# EAGLE schematic zikburner-r1 (EAGLE 6.4)
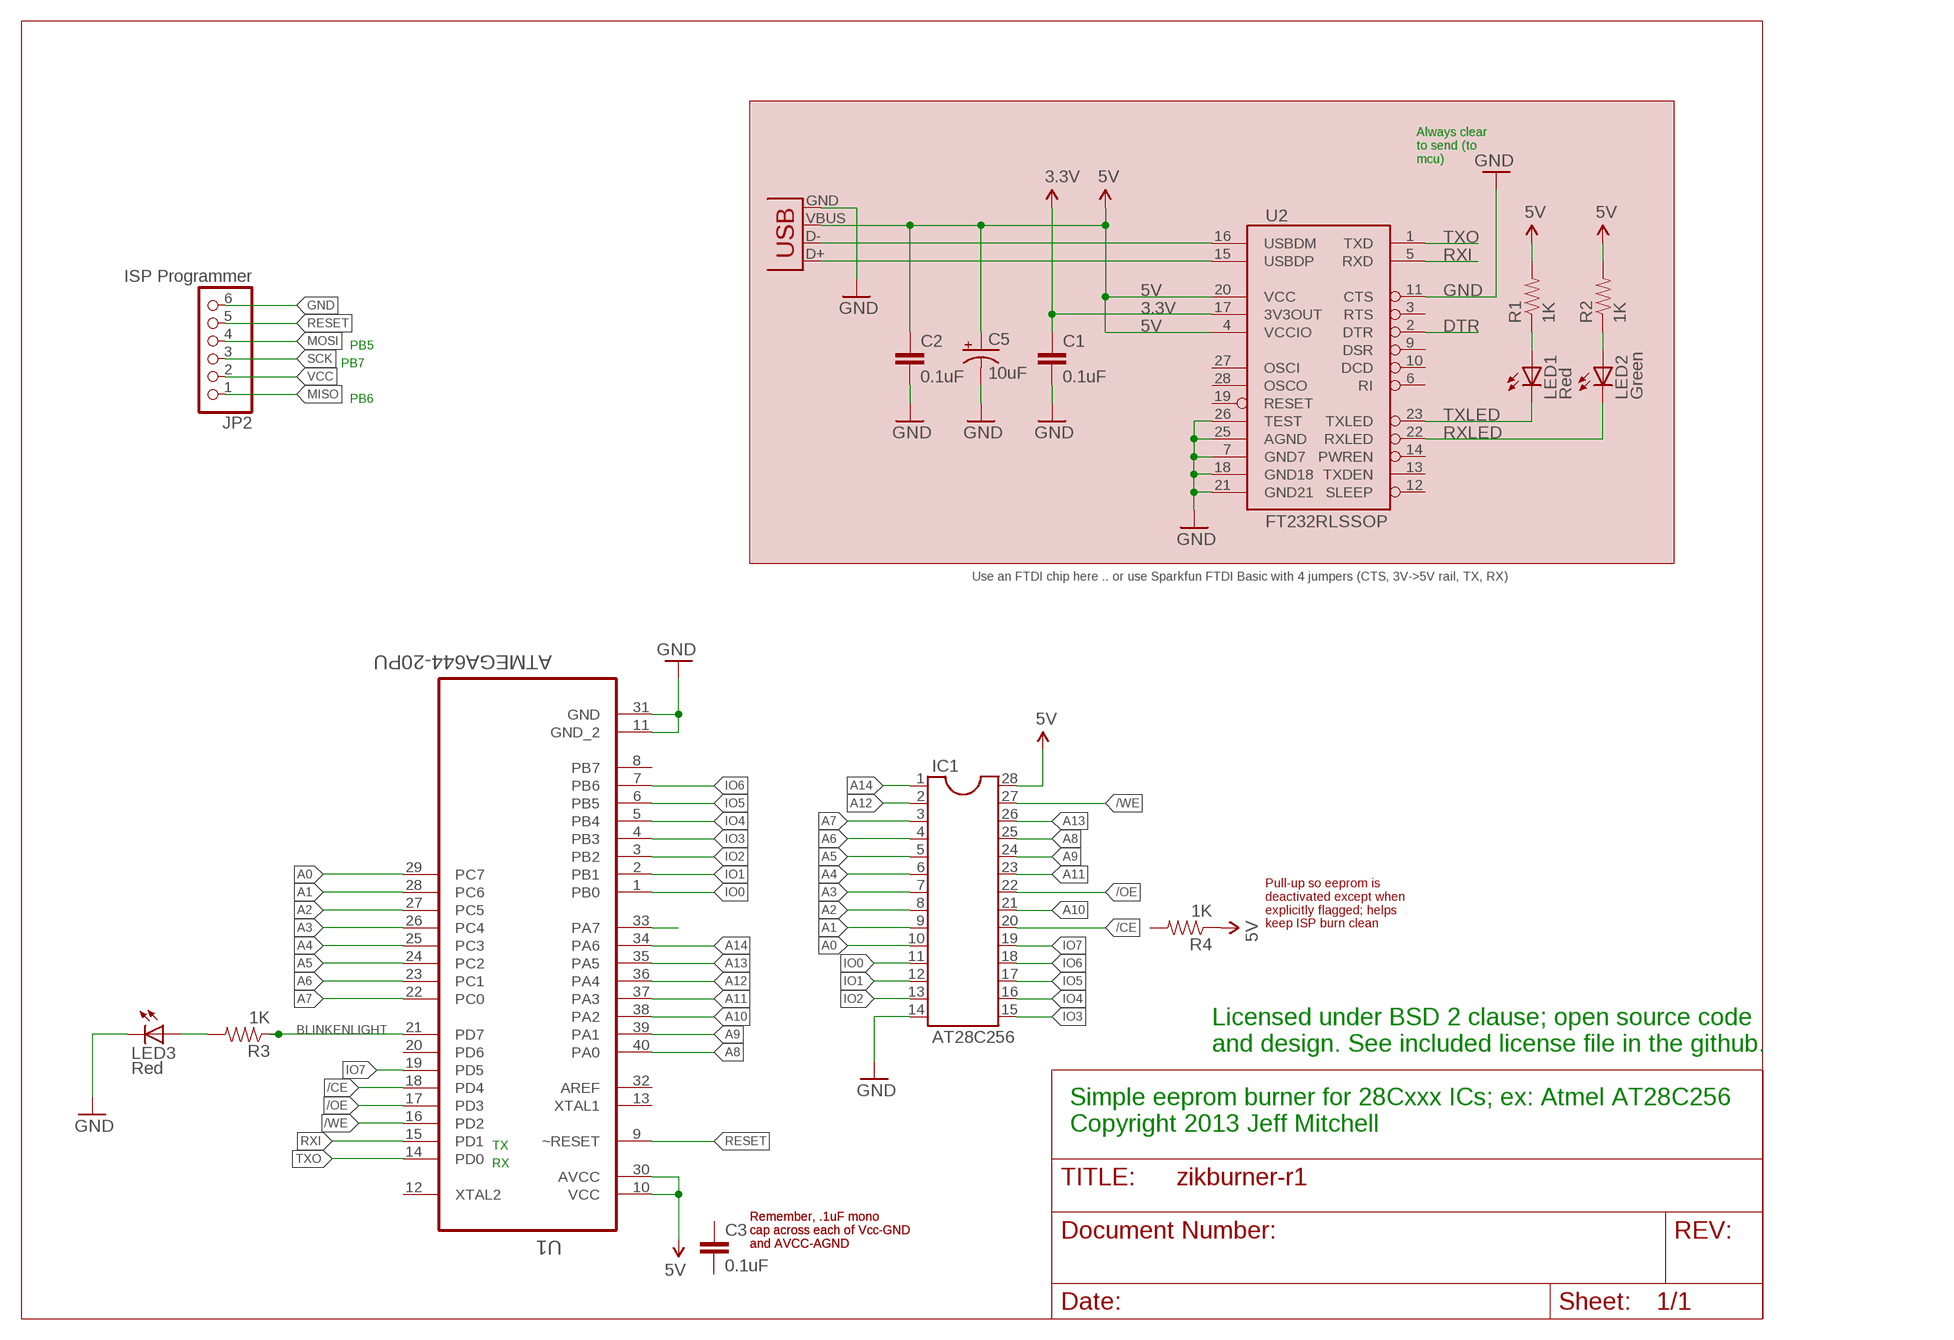
[diagram p0: schematic, sheet 1]

## Parts
C1  0.1uF  CAP0402-CAP  [0402-CAP]
C2  0.1uF  CAP0402-CAP  [0402-CAP]
C3  0.1uF  CAP0402-CAP  [0402-CAP]
C5  10uF  CAP_POL1206  [EIA3216]
IC1  AT28C256  DIL28  [DIL28-6]
JP2  ISP Programmer  PINHD-1X6  [1X06]
LED1  Red  LED0603  [LED-0603]
LED2  Green  LED0603  [LED-0603]
LED3  Red  LED0603  [LED-0603]
R1  1K  RESISTOR0402-RES  [0402-RES]
R2  1K  RESISTOR0402-RES  [0402-RES]
R3  1K  RESISTOR0402-RES  [0402-RES]
R4  1K  RESISTOR0402-RES  [0402-RES]
U1  ATMEGA644-20PU  [DIP254P1524X482-40]
U2  FT232RLSSOP  [SSOP28DB]
X2  USB-SMD-NS  [USB-MINIB-NOSTOP]

## Nets
3.3V [power]: C1.1 U2.17(3V3OUT)
5V: C2.1 C5.A(+) IC1.28 R1.2 R2.2 R4.1 U1.10(VCC) U1.30(AVCC) U2.4(VCCIO) U2.20(VCC) X2.VBUS
/CE: IC1.20 U1.18(PD4)
/OE: IC1.22 U1.17(PD3)
/WE: IC1.27 U1.16(PD2)
A0: IC1.10 U1.29(PC7)
A1: IC1.9 U1.28(PC6)
A2: IC1.8 U1.27(PC5)
A3: IC1.7 U1.26(PC4)
A4: IC1.6 U1.25(PC3)
A5: IC1.5 U1.24(PC2)
A6: IC1.4 U1.23(PC1)
A7: IC1.3 U1.22(PC0)
A8: IC1.25 U1.40(PA0)
A9: IC1.24 U1.39(PA1)
A10: IC1.21 U1.38(PA2)
A11: IC1.23 U1.37(PA3)
A12: IC1.2 U1.36(PA4)
A13: IC1.26 U1.35(PA5)
A14: IC1.1 U1.34(PA6)
BLINKENLIGHT: R3.1 U1.21(PD7)
DTR: U2.2(DTR)
GND [power]: C1.2 C2.2 C5.C(-) IC1.14 JP2.6 LED3.C U1.11(GND_2) U1.31(GND) U2.7(GND7) U2.11(CTS) U2.18(GND18) U2.21(GND21) U2.25(AGND) U2.26(TEST) X2.GND
IO0: IC1.11 U1.1(PB0)
IO1: IC1.12 U1.2(PB1)
IO2: IC1.13 U1.3(PB2)
IO3: IC1.15 U1.4(PB3)
IO4: IC1.16 U1.5(PB4)
IO5: IC1.17 U1.6(PB5)
IO6: IC1.18 U1.7(PB6)
IO7: IC1.19 U1.19(PD5)
MISO: JP2.1
MOSI: JP2.4
N$1: LED1.A R1.1
N$2: LED2.A R2.1
N$4: LED3.A R3.2
N$9: U1.33(PA7)
RESET: JP2.5 U1.9(~RESET)
RXI: U1.15(PD1) U2.5(RXD)
RXLED: LED2.C U2.22(RXLED)
SCK: JP2.3
TXLED: LED1.C U2.23(TXLED)
TXO: U1.14(PD0) U2.1(TXD)
USB_D+: U2.15(USBDP) X2.D+
USB_D-: U2.16(USBDM) X2.D-
VCC: JP2.2
Unconnected: C3.1 C3.2 R4.2 U1.8(PB7) U1.12(XTAL2) U1.13(XTAL1) U1.20(PD6) U1.32(AREF) U2.3(RTS) U2.6(RI) U2.9(DSR) U2.10(DCD) U2.12(SLEEP) U2.13(TXDEN) U2.14(PWREN) U2.19(RESET) U2.27(OSCI) U2.28(OSCO)

## Notes on the sheet
- Always clear
  to send (to
  mcu)
- PB5
- PB7
- PB6
- Use an FTDI chip here .. or use Sparkfun FTDI Basic with 4 jumpers (CTS, 3V->5V rail, TX, RX)
- Pull-up so eeprom is
  deactivated except when
  explicitly flagged; helps
  keep ISP burn clean
- Licensed under BSD 2 clause; open source code
  and design. See included license file in the github.
- Simple eeprom burner for 28Cxxx ICs; ex: Atmel AT28C256
  Copyright 2013 Jeff Mitchell
- TX
- RX
- Remember, .1uF mono
  cap across each of Vcc-GND
  and AVCC-AGND
- Remember, .1uF mono
  cap across each of Vcc-GND
  and AVCC-AGND

## Library data of the parts
C1-C3 = SparkFun:CAP: Capacitor Standard 0603 ceramic capacitor, and 0.1" leaded capacitor.
C5 = SparkFun:CAP_POL: Capacitor Polarized These are standard SMD and PTH capacitors. Normally 10uF, 47uF, and 100uF in electrolytic and tantalum varieties. Always verify the external diameter of the through hole cap, it varies with capacity, voltage, and manufacturer. The EIA devices should be standard.
IC1 = ic-package:DIL28: Dual In Line
JP2 = pinhead:PINHD-1X6: PIN HEADER
LED1-LED3 = SparkFun:LED: LEDs Standard schematic elements and footprints for 5mm, 3mm, 1206, and 0603 sized LEDs. 5mm - Spark Fun Electronics SKU : COM-00529 (and others)
R1-R4 = SparkFun:RESISTOR: Resistor Basic schematic elements and footprints for 0603, 1206, and PTH resistors.
U1 = Atmel_By_element14_Batch_1:ATMEGA644-20PU: 8-bit Microcontroller with 64K Bytes In-System Programmable Flash; MPN: ATMEGA644-20PU; OC_FARNELL: 1288340; OC_NEWARK: 23M5060; PACKAGE: DIP-40; SUPPLIER: Atmel
U2 = SparkFun:FT232RL: USB UART FT232RL 4th Generation USB UART (USB <-> Serial) Controller. Spark Fun Electronics SKU : COM-00650
X2 = SparkFun:USB: USB Connectors USB-B-PTH is fully proven SKU : PRT-00139 USB-miniB is fully proven SKU : PRT-00587 USB-A-PCB is untested. USB-A-H is throughly reviewed, but untested. Spark Fun Electronics SKU : PRT-00437 USB-B-SMT is throughly reviewed, but untested. Needs silkscreen touching up. USB-A-S has not been used/tested USB-MB-H has not been used/tested

## Net classes
0 default: width 0.203 mm
1 power: width 0.254 mm